# EasyEDA Pro project Project.epro

# Schematic Schematic1
Board Name: Board1; Create Date: 2026-04-29; Page Name: P1; Project Name: usb hub; Schematic Name: Schematic1; Update Date: 2026-05-01; Company: EasyEDA.com; Page Size: A4; Version: V1.0
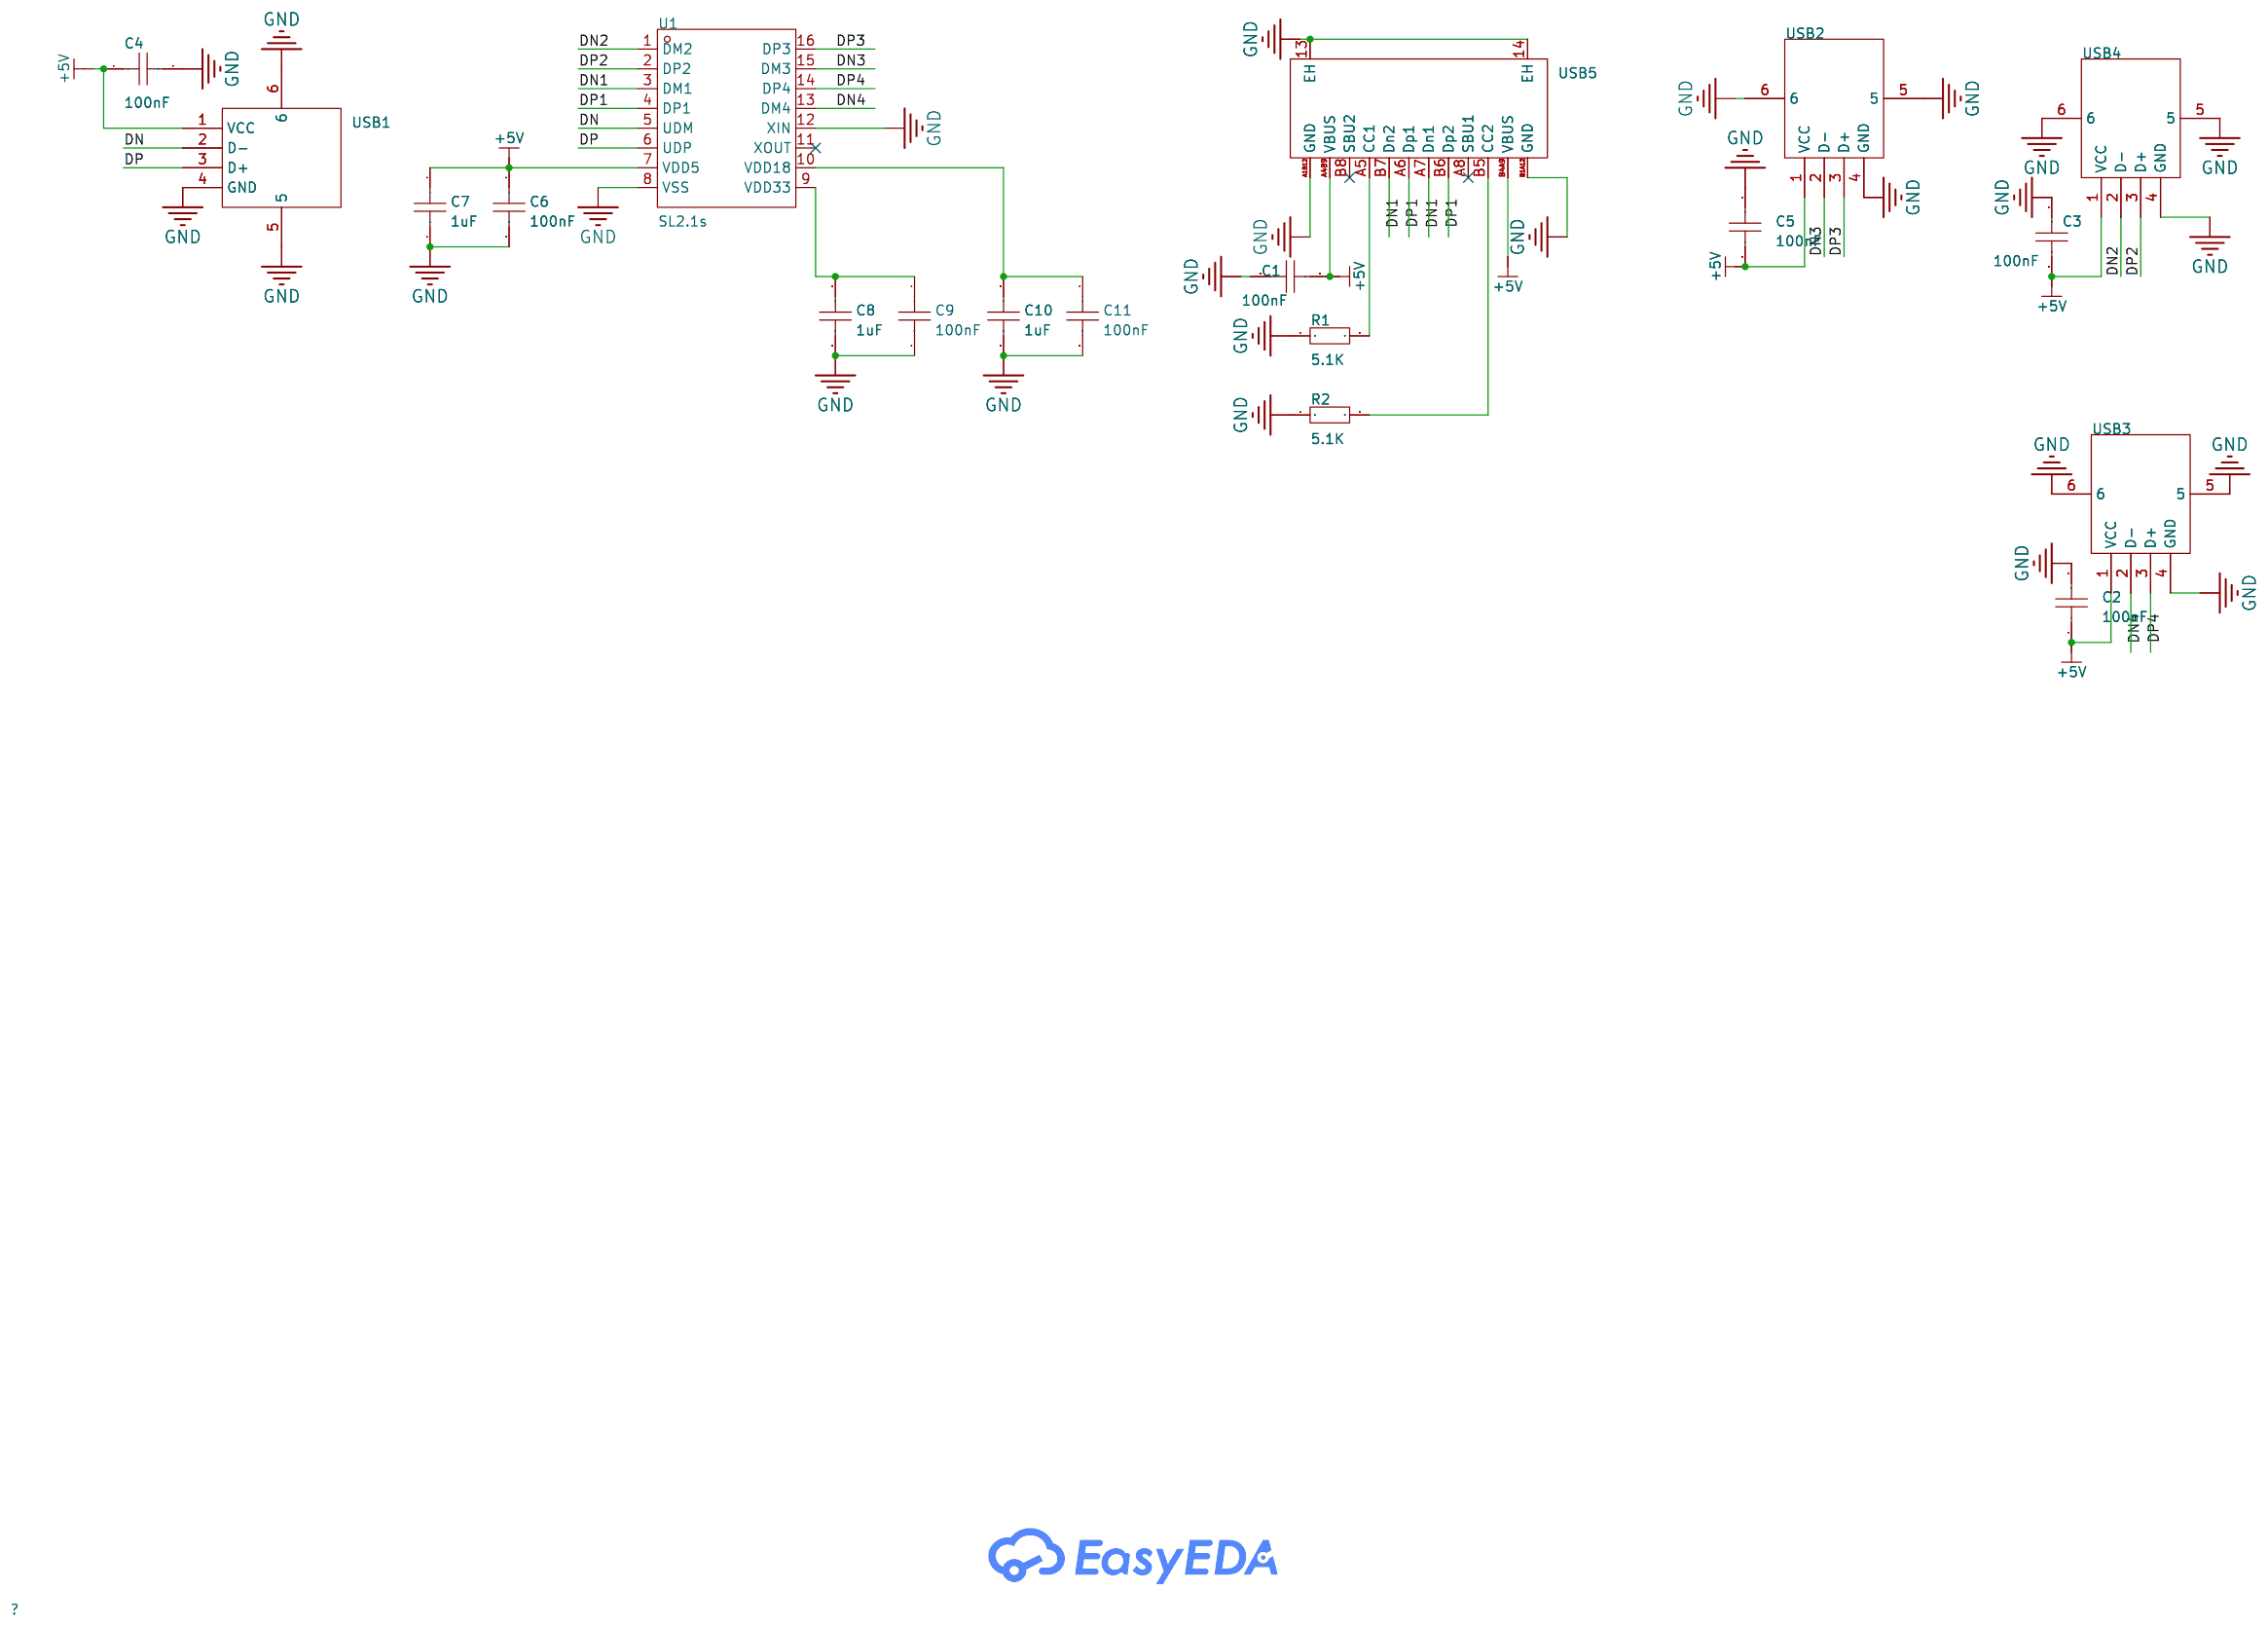
[diagram p0: schematic sheet]

## Parts
C1  100nF  [C0603]
C2  100nF  [C0603]
C3  100nF  [C0603]
C4  100nF  [C0603]
C5  100nF  [C0603]
C6  100nF  [C0603]
C7  1uF  [C0603]
C8  1uF  [C0603]
C9  100nF  [C0603]
C10  1uF  [C0603]
C11  100nF  [C0603]
R1  5.1K  [R0603]
R2  5.1K  [R0603]
U1  SL2.1s  [SSOP-16_L4.6-W2.6-P0.53-LS4.0-BL]
USB1  10.0 QHHTZB6.3  [USB-A-TH_10.0QHHTZB6.3]
USB2  10.0 QHHTZB6.3  [USB-A-TH_10.0QHHTZB6.3]
USB3  10.0 QHHTZB6.3  [USB-A-TH_10.0QHHTZB6.3]
USB4  10.0 QHHTZB6.3  [USB-A-TH_10.0QHHTZB6.3]
USB5  TYPE-C 16PIN 2MD(073)  [USB-C-SMD_TYPE-C-16PIN-2MD-073]

## Library data of the parts
C1-C11 = CAP_0603: Supplier Footprint: 0603
R1 R2 = Res_0603: Supplier Footprint: 0603
U1 = SL2.1s: type:Hub USB Protocol:USB 2.0 Data Rate:- Voltage - Supply:4V~5.25V Voltage - Supply:4V~5.25V Operating Temperature:0℃~+70℃ Operating Temperature:0℃~+70℃ Memory Interface:- Current - Supply:120mA Quiescent Supply Current:2.5mA Number of Channels:4; LCSC Part Name: USB2.0 HUB控制器集成电路; Supplier Part: C2684433; Manufacturer: CoreChips(和芯润德); Supplier Footprint: SSOP-16; JLCPCB Part Class: Extended Part; Datasheet: https://item.szlcsc.com/datasheet/SL2.1s/2782346.html; Supplier: LCSC; type: Hub; USB Protocol: USB 2.0; Voltage - Supply: 4V~5.25V; Operating Temperature: 0℃~+70℃; Current - Supply: 120mA; Quiescent Supply Current: 2.5mA; Number of Channels: 4
USB1-USB4 = 10.0 QHHTZB6.3: Connector Type:Type-A Protocol Standard:USB 2.0 Gender:Female Mounting Type:Surface Mount, Right Angle Number of Contacts:4P Number of Ports:1 Current Rating-Power:1.5A Voltage Rating:30V Connect-Disconnect Life:5,000 times Supplementary Features:- Center; LCSC Part Name: 壳长10.0mm; Supplier Part: C668591; Manufacturer: SHOU HAN(首韩); Supplier Footprint: SMD; JLCPCB Part Class: Extended Part; Datasheet: https://item.szlcsc.com/datasheet/10.0%2520QHHTZB6.3/698534.html; Supplier: LCSC; Connector Type: Type-A; Protocol Standard: USB 2.0; Gender: Female; Mounting Type: Surface Mount, Right Angle; Number of Contacts: 4P; Number of Ports: 1; Current Rating-Power: 1.5A; Voltage Rating: 30V; Connect-Disconnect Life: 5,000 times; Length: 10mm; Detection color: Black; Operating Temperature: -25℃~+85℃
USB5 = TYPE-C 16PIN 2MD(073): Connector Type:Type-C Protocol Standard:- Gender:Female Mounting Type:Surface Mount, Right Angle Number of Contacts:16P Number of Ports:1 Current Rating-Power:3A Voltage Rating:5V Connect-Disconnect Life:10,000 Cycles Supplementary Features:- Center Heigh; LCSC Part Name: Type-C 母 卧贴; Supplier Part: C2765186; Manufacturer: SHOU HAN(首韩); Supplier Footprint: SMD; JLCPCB Part Class: Extended Part; Datasheet: https://item.szlcsc.com/datasheet/TYPE-C%252016PIN%25202MD(073)/2901843.html; Supplier: LCSC; Connector Type: Type-C; Gender: Female; Mounting Type: Surface Mount, Right Angle; Number of Contacts: 16P; Number of Ports: 1; Current Rating-Power: 3A; Voltage Rating: 5V; Connect-Disconnect Life: 10,000 Cycles; Detection color: Black; Operating Temperature: -25℃~+85℃

## Nets
+5V: C1.1 C2.1 C3.2 C4.1 C5.2 C6.1 C7.1 U1.7(VDD5) USB1.1(VCC) USB2.1(VCC) USB3.1(VCC) USB4.1(VCC) USB5.A4B9(VBUS) USB5.B4A9(VBUS)
GND: C1.2 C2.2 C3.1 C4.2 C5.1 C6.2 C7.2 C8.2 C9.2 C10.2 C11.2 R1.1 R2.1 U1.8(VSS) U1.12(XIN) USB1.4(GND) USB1.5 USB1.6 USB2.4(GND) USB2.5 USB2.6 USB3.4(GND) USB3.5 USB3.6 USB4.4(GND) USB4.5 USB4.6 USB5.13(EH) USB5.14(EH) USB5.A1B12(GND) USB5.B1A12(GND)
DN: U1.5(UDM) USB1.2(D-)
DN1: U1.3(DM1) USB5.A7(Dn1) USB5.B7(Dn2)
DN2: U1.1(DM2) USB4.2(D-)
DN3: U1.15(DM3) USB2.2(D-)
DN4: U1.13(DM4) USB3.2(D-)
DP: U1.6(UDP) USB1.3(D+)
DP1: U1.4(DP1) USB5.A6(Dp1) USB5.B6(Dp2)
DP2: U1.2(DP2) USB4.3(D+)
DP3: U1.16(DP3) USB2.3(D+)
DP4: U1.14(DP4) USB3.3(D+)
$1N1345: R2.2 USB5.B5(CC2)
$1N1392: R1.2 USB5.A5(CC1)
$1N2467: C8.1 C9.1 U1.9(VDD33)
$1N2472: C10.1 C11.1 U1.10(VDD18)

Not connected (* = marked no-connect by the designer): U1 11(XOUT)*; USB5 A8(SBU1)* B8(SBU2)*

# Board PCB1
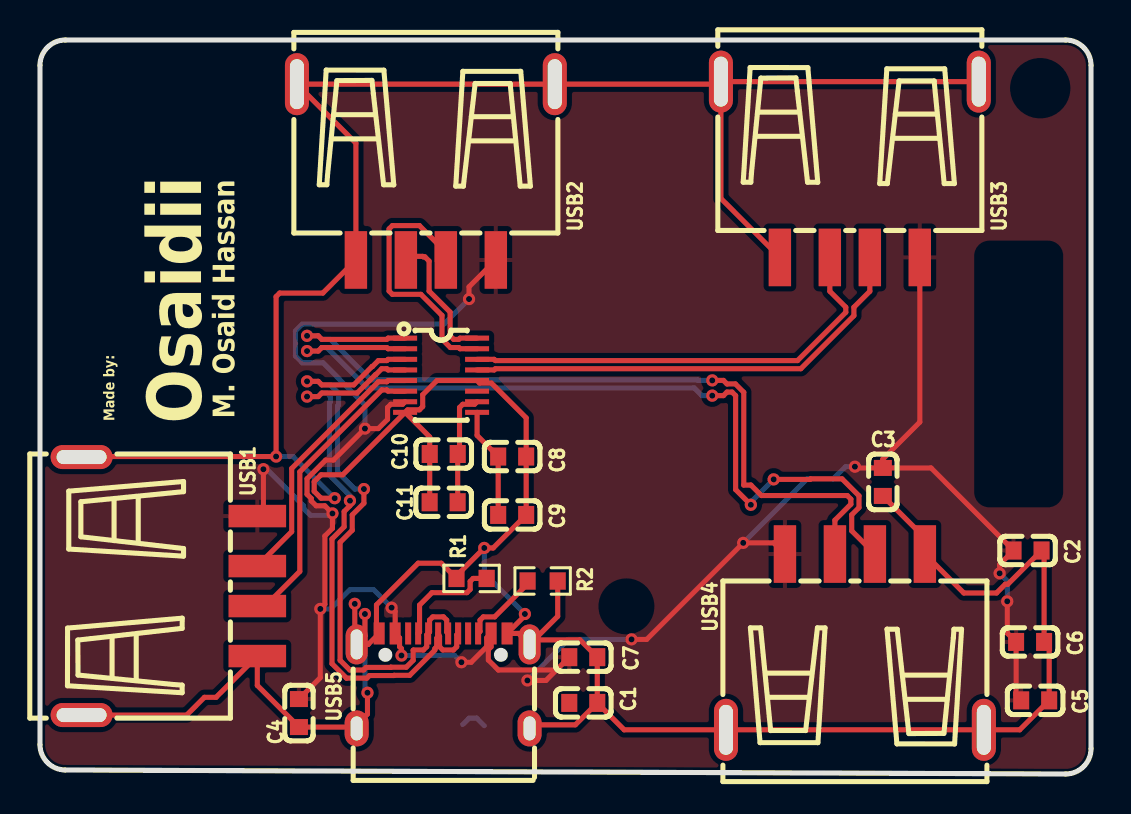
[diagram p1: board, top side]
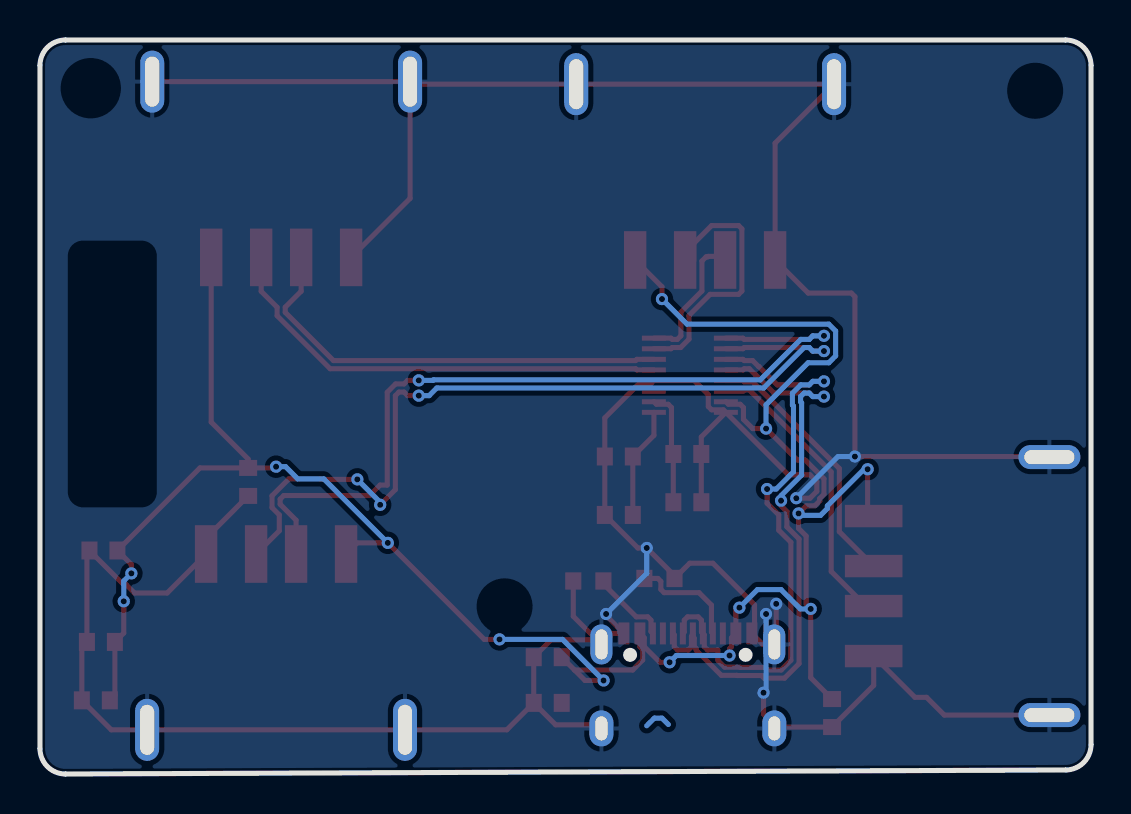
[diagram p2: board, bottom side, seen from below]

Outline 52.58 x 36.7 mm; copper layers: Top Layer, Bottom Layer. Coordinates in mm from the lower left corner of the outline.
Outline path: 0,35.43 arc(0.37,36.33) 1.27,36.7 51.31,36.7 arc(52.21,36.33) 52.58,35.43 52.58,1.27 arc(52.21,0.37) 51.31,0 1.27,0.2 arc(0.37,0.57) 0,1.47 0,35.43
Stack: Top Layer 0.035mm / Dielectric1 1.51mm FR4 er 4.5 / Bottom Layer 0.035mm

## Design rules (mm)
net DN2: DP3
net DP2: DP3
net DN1: DP2
net DP1: DP2
net DN: DP1
net DP: DP1
net DN4: DP4
net DP4: DP4
net DN3: DP5
net DP3: DP5
template: Custom Config
spacing copperThickness1oz (default): track to track 0.102, other pairs 0.07 to 0.3
spacing copperThickness2oz: track to track 0.203, other pairs 0.152 to 0.3
track width copperThickness1oz (default): min 0.127, default 0.254, max 2.54
track width copperThickness2oz: min 0.203, default 0.254, max 2.54
differential pair differentialPair (default): width min 0.127, default 0.254, max 2.54; gap min 0.152, default 0.152
via viaSize (default): diameter min 0.5, default 0.61, max 10; hole min 0.3, default 0.305, max 6.3

## Placement (name value [footprint] x y rotation side)
C1  100nF  [C0603]  27.18 3.56 0 top
C2  100nF  [C0603]  49.4 11.18 0 top
C3  100nF  [C0603]  42.16 14.6 90 top
C4  100nF  [C0603]  12.95 3.05 270 top
C5  100nF  [C0603]  49.78 3.68 180 top
C6  100nF  [C0603]  49.53 6.6 0 top
C7  1uF  [C0603]  27.18 5.84 0 top
C8  1uF  [C0603]  23.62 15.88 0 top
C9  100nF  [C0603]  23.62 12.95 0 top
C10  1uF  [C0603]  20.2 16 180 top
C11  100nF  [C0603]  20.19 13.59 180 top
R1  5.1K  [R0603]  21.59 9.78 0 top
R2  5.1K  [R0603]  25.15 9.65 180 top
U1  SL2.1s  [SSOP-16_L4.6-W2.6-P0.53-LS4.0-BL]  20.07 19.94 270 top
USB1  10.0 QHHTZB6.3  [USB-A-TH_10.0QHHTZB6.3]  6.48 9.4 270 top
USB2  10.0 QHHTZB6.3  [USB-A-TH_10.0QHHTZB6.3]  19.3 30.1 180 top
USB3  10.0 QHHTZB6.3  [USB-A-TH_10.0QHHTZB6.3]  40.51 30.23 180 top
USB4  10.0 QHHTZB6.3  [USB-A-TH_10.0QHHTZB6.3]  40.77 6.6 0 top
USB5  TYPE-C 16PIN 2MD(073)  [USB-C-SMD_TYPE-C-16PIN-2MD-073]  20.17 4.65 0 top

## Footprints (pads in the part's own frame, mm; a bottom-side part is the same pattern mirrored in y, then rotated)
C0603
  rect 0.8x0.9 smd: 1(-0.7,0) 2(0.7,0)
R0603
  rect 0.806x0.864 smd: 1(-0.753,0) 2(0.753,0)
SSOP-16_L4.6-W2.6-P0.53-LS4.0-BL
  rect 0.25x1.2 smd: 1(-1.855,-1.8) 2(-1.325,-1.8) 3(-0.795,-1.8) 4(-0.265,-1.8) 5(0.265,-1.8) 6(0.795,-1.8) 7(1.325,-1.8) 8(1.855,-1.8) 9(1.855,1.8) 10(1.325,1.8) 11(0.795,1.8) 12(0.265,1.8) 13(-0.265,1.8) 14(-0.795,1.8) 15(-1.325,1.8) 16(-1.855,1.8)
USB-A-TH_10.0QHHTZB6.3
  rect 1.12x2.88 smd: 1(-3.5,4.395) 2(-1,4.395) 3(1,4.395) 4(3.5,4.395)
  oval 1.2x3.1 hole 0.7x2.5: 5(-6.45,-4.395) 6(6.45,-4.395)
USB-C-SMD_TYPE-C-16PIN-2MD-073
  oval 1.1x2 hole 0.6x1.5: 13(-4.325,1.825) 14(4.325,1.825)
  oval 1.2x1.8 hole 0.6x1.2: 13(-4.325,-2.375) 14(4.325,-2.375)
  rect 0.55x1.1 smd: A1B12(-3.2,2.375) A4B9(-2.4,2.375) B1A12(3.2,2.375) B4A9(2.4,2.375)
  rect 0.3x1.1 smd: A5(-1.25,2.375) A6(-0.25,2.375) A7(0.25,2.375) A8(1.25,2.375) B5(1.75,2.375) B6(0.75,2.375) B7(-0.75,2.375) B8(-1.75,2.375)

## Nets
As in the schematic, except:
+5V: C2.1 C3.2 C4.1 C5.2 C6.1 C7.1 U1.7 USB1.1 USB2.1 USB3.1 USB4.1 USB5.A4B9 USB5.B4A9

Pads without a net: C1 1; U1 11; USB5 A8 B8

## Via types
v1: diameter 0.61, hole 0.305, Top Layer to Bottom Layer, 31 vias

## Routing (per net, layer and track width the routed paths; a pad name or vN(x,y) marks a point on that pad's centre or on a via; arc(x,y) is an arc through that point)
+5V: length 117.4
  Top Layer w0.254: USB2.1 21.46,24.36 v1(21.46,23.75) ; C3.2 44.57,15.3 C2.1 48.01,10.48 v1(48.01,10.03) ; C3.2 40.83,15.3 v1(40.77,15.37) ; C3.2 42.16,15.75 44.01,17.6 USB3.1 ; v1(24.38,4.68) 25.31,4.68 25.84,5.2 ; 25.84,5.2 C7.1 ; 25.84,5.2 22.93,5.2 22.43,5.7 22.43,6.22 22.57,6.36 USB5.B4A9 22.35,6.81 22.35,6.36 21.57,5.59 v1(21.08,5.59) ; v1(48.39,8.64) 48.39,7.05 C6.1 48.83,3.94 49.08,3.68 ; v1(18.08,5.93) 18.08,6.27 17.99,6.36 17.99,6.81 USB5.A4B9 17.77,8.14 v1(17.59,8.32) ; USB1.1 11.18,13.2 v1(11.18,15.24) ; 18.27,18.61 18.14,18.49 17.55,18.49 17.39,18.32 17.39,17.73 16.92,17.27 v1(16.26,17.27) 14.68,15.7 14.29,15.7 13.36,14.77 13.36,13.99 13.57,13.78 13.57,13.66 13.82,13.41 14.25,13.41 v1(14.63,13.03) 14.63,12.28 14.25,11.9 14.25,8.48 v1(14.02,8.25) 14.02,4.82 12.95,3.75 ; v1(29.59,6.73) 30.35,6.73 v1(35.18,11.56) 36.71,11.56 USB4.1
  Bottom Layer w0.254: v1(14.63,13.03) 14.54,12.93 13.53,12.93 13.19,13.28 13.19,13.41 11.36,15.24 v1(11.18,15.24) ; v1(21.46,23.75) 20.21,22.49 13.12,22.49 12.78,22.15 12.78,20.91 13.12,20.56 14.15,20.56 16.26,18.46 v1(16.26,17.27) ; v1(48.01,10.03) 48.39,9.65 v1(48.39,8.64) ; v1(35.18,11.56) 38.38,14.76 39.68,14.76 40.29,15.37 v1(40.77,15.37) ; v1(14.02,8.25) 14.54,8.25 15.51,9.22 16.69,9.22 v1(17.59,8.32) ; v1(29.59,6.73) 26.44,6.73 v1(24.38,4.68) ; v1(18.08,5.93) 20.74,5.93 v1(21.08,5.59)
GND: length 208.1
  Top Layer w0.254: v1(15.75,8.51) 15.75,7.15 16.13,6.77 ; 16.13,6.77 16.26,6.89 v1(16.26,8) ; 16.13,6.77 USB5.13 16.42,6.48 USB5.A1B12 16.83,7.16 16.83,8.46 18.92,10.54 20.07,10.54 R1.1 20.84,9.91 v1(22.23,11.3) 22.67,11.3 C9.2 C8.2 24.32,17.81 22.58,19.55 21.99,19.55 U1.12 19.86,19.67 19.14,18.96 19.14,18.37 18.98,18.21 18.39,18.21 18.27,18.08 ; C3.1 44.27,11.8 USB4.4 46.21,9.05 47.85,9.05 48.29,9.49 48.42,9.49 C2.2 50.23,11.05 50.23,6.6 50.48,6.35 C5.1 49.01,2.21 USB4.6 USB4.5 29.23,2.21 27.88,3.56 ; v1(24.26,8) 24.26,7.92 USB5.B1A12 23.94,7.03 USB5.14 ; 18.27,18.08 15.14,14.96 14.06,14.96 13.72,14.62 13.72,14.13 14.06,13.79 v1(14.74,13.79) ; 18.27,18.08 19.5,16.85 C10.2 19.5,13.59 C11.2 ; v1(16.38,4.06) 16.38,3 15.84,2.46 ; 27.88,3.56 27.88,5.84 27.01,6.71 24.72,6.71 25.9,7.89 R2.1 ; 27.88,3.56 26.78,2.46 24.49,2.46 ; USB5.13 15.77,2.35 C4.2 10.87,4.43 USB1.4 8.81,3.83 8.23,3.83 7.34,2.95 USB1.6 ; USB3.5 USB3.6 ; USB3.6 33.94,34.49 12.85,34.49 15.8,31.54 USB2.4 14.15,24.05 11.99,24.05 11.81,23.87 v1(11.81,15.88) 2.11,15.88 USB1.5 ; USB3.6 34.06,28.78 USB3.4
  Bottom Layer w0.254: v1(14.74,13.79) 12.66,15.88 v1(11.81,15.88) ; v1(22.23,11.3) 22.23,10.03 v1(24.26,8) ; v1(16.26,8) 16.26,4.19 v1(16.38,4.06)
(no net): length 1.4
  Bottom Layer w0.254: 21.15,2.48 21.46,2.79 21.84,2.79 22.23,2.41
DN: length 13.1
  Top Layer w0.254: USB1.2 12.59,12.12 12.59,15.28 16.93,19.61 17.35,19.61 17.41,19.67 18.27,19.67
DN1: length 30.4
  Top Layer w0.254: v1(13.36,19.63) 13.92,19.63 14.1,19.46 15.69,19.46 16.61,20.37 16.63,20.37 16.93,20.67 17.35,20.67 17.41,20.73 18.27,20.73 ; v1(16.2,14.25) 16.2,13.54 15.62,12.95 15.62,12.19 15.01,11.58 15.01,5.69 15.5,5.2 16.19,5.2 16.32,5.33 17.54,5.33 17.55,5.34 18.33,5.34 18.67,5.68 18.67,6.19 18.68,6.2 19.18,6.2 19.35,6.36 19.35,6.96 USB5.B7 19.49,7.1 19.49,7.69 19.65,7.86 20.18,7.86 20.35,7.69 20.35,7.1 USB5.A7
  Bottom Layer w0.254: v1(13.36,19.63) 13.92,19.63 14.1,19.46 14.52,19.46 14.94,19.04 14.94,18.45 14.88,18.4 14.88,15.11 15.75,14.25 v1(16.2,14.25)
DN2: length 41.4
  Top Layer w0.254: USB4.2 39.77,12.69 40.56,13.49 40.56,13.74 40.38,13.92 36.09,13.92 35.57,14.45 35.21,14.45 35.21,19.09 34.79,19.5 34.37,19.5 34.19,19.68 v1(33.63,19.68) ; v1(13.36,21.91) 13.92,21.91 14.1,21.73 17.35,21.73 17.41,21.79 18.27,21.79
  Bottom Layer w0.254: v1(13.36,21.91) 13.92,21.91 14.1,21.73 14.52,21.73 16.54,19.71 32.89,19.71 32.92,19.68 v1(33.63,19.68)
DN3: length 13.1
  Top Layer w0.254: U1.15 21.01,21.26 20.95,21.33 20.53,21.33 20.11,21.74 20.11,22.93 19.05,23.98 17.63,23.98 17.46,24.15 17.46,27.26 17.63,27.42 18.98,27.42 19.87,26.53 19.87,25.65
DN4: length 23.2
  Top Layer w0.254: U1.13 22.72,20.2 22.78,20.27 38.06,20.27 40.72,22.92 40.72,23.34 41.51,24.14 USB3.2
DP: length 14.8
  Top Layer w0.254: USB1.3 11.27,8.4 13,10.13 13,15.11 17.1,19.21 17.35,19.21 17.41,19.14 18.27,19.14
DP1: length 30.3
  Top Layer w0.254: 18.27,20.2 17.41,20.2 17.35,20.27 17.1,20.27 16.8,19.97 16.78,19.97 15.86,19.05 14.1,19.05 13.92,18.87 v1(13.36,18.87) ; v1(15.51,13.66) 15.51,13.41 15.21,13.12 15.21,12.36 14.61,11.75 14.61,5.52 15.33,4.79 16.35,4.79 16.48,4.92 17.71,4.92 17.72,4.94 18.49,4.94 19.75,6.19 19.75,6.27 19.85,6.36 19.85,6.79 19.92,6.86 USB5.A6 19.94,7.01 19.94,6.93 19.99,6.88 19.99,6.36 20.15,6.2 20.68,6.2 20.85,6.36 20.85,6.96 USB5.B6
  Bottom Layer w0.254: v1(13.36,18.87) 13.92,18.87 14.1,19.05 14.35,19.05 14.53,18.87 14.53,18.62 14.48,18.56 14.48,14.94 15.51,13.92 v1(15.51,13.66)
DP2: length 43.3
  Top Layer w0.254: v1(35.56,13.46) 34.8,14.22 34.8,18.92 34.62,19.1 34.37,19.1 34.19,18.92 v1(33.63,18.92) ; v1(36.7,14.73) 38.52,14.73 38.55,14.76 40.12,14.76 40.97,13.91 40.97,13.32 40.61,12.96 40.61,12.16 USB4.3 ; 18.27,21.26 17.41,21.26 17.35,21.33 14.1,21.33 13.92,21.15 v1(13.36,21.15)
  Bottom Layer w0.254: v1(33.63,18.92) 33.11,18.92 32.72,19.3 16.37,19.3 14.35,21.33 14.1,21.33 13.92,21.15 v1(13.36,21.15) ; v1(35.56,13.46) 35.56,13.59 v1(36.7,14.73)
DP3: length 7
  Top Layer w0.254: USB2.3 18.48,25.88 19.15,25.88 19.17,25.86 19.26,25.86 19.46,25.65 19.46,24.15 20.52,23.1 20.52,21.91 20.7,21.73 20.95,21.73 21.01,21.79 U1.16
DP4: length 22.5
  Top Layer w0.254: U1.14 22.72,20.73 22.78,20.67 37.9,20.67 40.31,23.09 40.31,23.34 39.51,24.14 USB3.3
$1N1345: length 4
  Top Layer w0.254: USB5.B5 22.01,7.12 22.01,7.69 22.18,7.86 22.75,7.86 24.39,9.5 R2.2
$1N1392: length 5.6
  Top Layer w0.254: R1.2 21.67,9.78 21.52,9.63 21.52,9.23 21.36,9.07 19.61,9.07 18.99,8.45 18.99,7.1 USB5.A5
$1N2467: length 5.6
  Top Layer w0.254: U1.9 21.87,16.93 C8.1 C9.1
$1N2472: length 5.8
  Top Layer w0.254: C11.1 20.9,13.59 C10.1 20.99,16.09 20.99,18.32 21.15,18.49 21.74,18.49 U1.10

## Copper pours and planes (outline as drawn; the poured copper is in the pictures)
+5V on Top Layer: 53.21,-0.64 53.47,37.72 -0.76,37.47 -0.76,-0.64
GND on Bottom Layer: -0.76,37.47 53.47,37.72 53.21,-0.64 -0.76,-0.64

## Text on the board
Bottom Solder Mask Layer: https://github.com/Osaidii/USB-Hub | USB HUB V1.0
Top Silkscreen Layer: Made by: | M. Osaid Hassan | Osaidii
